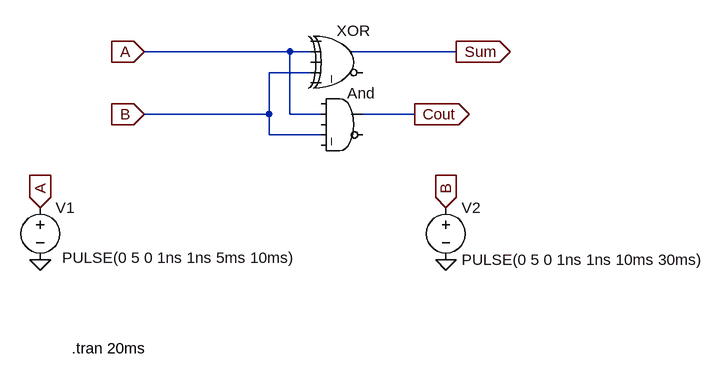
[diagram p0: schematic P1_Half_adder.asc]
P1_Half_adder.asc, the LTspice schematic file:
Version 4
SHEET 1 880 680
WIRE -208 -32 -432 -32
WIRE -176 -32 -208 -32
WIRE 48 -32 -112 -32
WIRE -176 0 -240 0
WIRE -240 64 -240 0
WIRE -240 64 -432 64
WIRE -208 64 -208 -32
WIRE -160 64 -208 64
WIRE -16 64 -96 64
WIRE -240 96 -240 64
WIRE -160 96 -240 96
FLAG 48 -32 Sum
IOPIN 48 -32 Out
FLAG -16 64 Cout
IOPIN -16 64 Out
FLAG -432 -32 A
IOPIN -432 -32 In
FLAG -432 64 B
IOPIN -432 64 In
FLAG -592 288 0
FLAG 32 288 0
FLAG -592 208 A
IOPIN -592 208 In
FLAG 32 208 B
IOPIN 32 208 In
SYMBOL Digital\\xor -128 -80 R0
SYMATTR InstName XOR
SYMBOL Digital\\and -128 16 R0
SYMATTR InstName And
SYMBOL voltage -592 192 R0
WINDOW 3 34 93 Left 2
WINDOW 123 0 0 Left 0
WINDOW 39 0 0 Left 0
SYMATTR Value PULSE(0 5 0 1ns 1ns 5ms 10ms)
SYMATTR InstName V1
SYMBOL voltage 32 192 R0
WINDOW 123 0 0 Left 0
WINDOW 39 0 0 Left 0
SYMATTR InstName V2
SYMATTR Value PULSE(0 5 0 1ns 1ns 10ms 30ms)
TEXT -544 424 Left 2 !.tran 20ms

The netlist it stands for:
* P1_Half_adder.asc
A§XOR 0 A 0 B 0 0 Sum 0 XOR
And 0 A 0 B 0 0 Cout 0 AND
V1 A 0 PULSE(0 5 0 1ns 1ns 5ms 10ms)
V2 B 0 PULSE(0 5 0 1ns 1ns 10ms 30ms)
.tran 20ms
.backanno
.end